# Altium schematic sheet USB_UART.SchDoc
size A4; DocumentNumber: 29; SheetNumber: 29; SheetTotal: 30
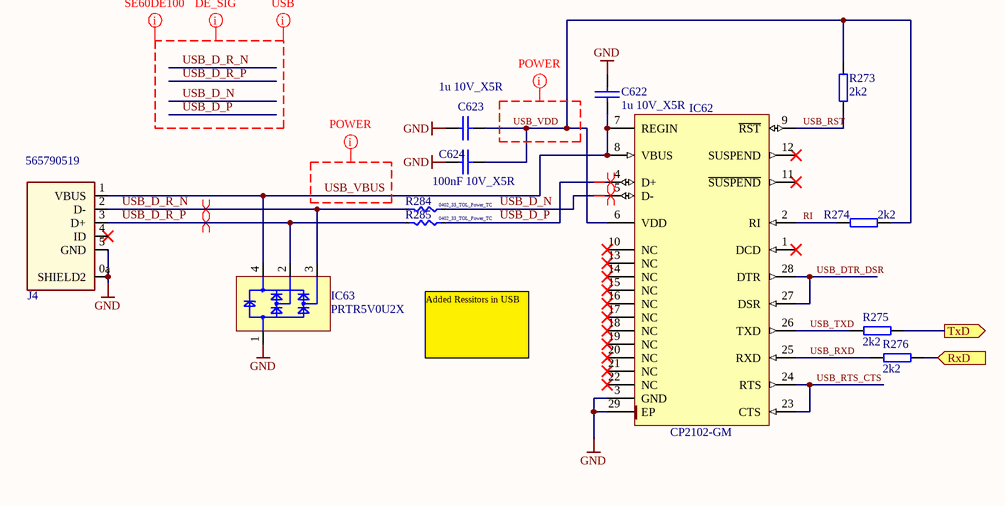
[diagram p0: USB_UART.SchDoc]

## Parts
C622  1u 10V_X5R  [0603C]
C623  1u 10V_X5R  [0603C]
C624  100nF 10V_X5R  [0402C]
IC62  CP2102-GM  [QFN50P500X500X100-29N-S335]
IC63  PRTR5V0U2X  [sot143b]
J4  565790519  [CON_USB_565790519]
R273  2k2  [0402R]
R274  2k2  [0402R]
R275  2k2  [0402R]
R276  2k2  [0402R]
R284  0402_33_TOL_Power_TC  [RESC1005X40N]
R285  0402_33_TOL_Power_TC  [RESC1005X40N]

## Ports
RxD (in), TxD (out)

## Nets
GND: C622.1 C623.1 C624.1 IC62.3(GND) IC62.29(EP) IC63.1 J4.0(SHIELD2) J4.0a(SHIELD2) J4.5(GND)
RI: IC62.2(RI) R274.1
RxD: R276.1 ; port RxD
TxD: R275.1 ; port TxD
USB_D_N: IC62.5(D-) R284.2(-)
USB_D_P: IC62.4(D+) R285.2(-)
USB_D_R_N: IC63.3 J4.2(D-) R284.1(+)
USB_D_R_P: IC63.2 J4.3(D+) R285.1(+)
USB_DTR_DSR: IC62.27(DSR) IC62.28(DTR)
USB_RST: IC62.9(~{RST}) R273.1
USB_RTS_CTS: IC62.23(CTS) IC62.24(RTS)
USB_RXD: IC62.25(RXD) R276.2
USB_TXD: IC62.26(TXD) R275.2
USB_VBUS: C622.2 IC62.7(REGIN) IC62.8(VBUS) IC63.4 J4.1(VBUS)
USB_VDD: C623.2 C624.2 IC62.6(VDD) R273.2 R274.2

Not connected (* = marked no-connect by the designer): IC62 1(DCD)* 10(NC)* 11(~{SUSPEND})* 12(SUSPEND)* 13(NC)* 14(NC)* 15(NC)* 16(NC)* 17(NC)* 18(NC)* 19(NC)* 20(NC)* 21(NC)* 22(NC)*; J4 4(ID)*

## Layout directives
differential pair: USB_D_N, USB_D_P, USB_D_R_N, USB_D_R_P
net class POWER: USB_VBUS, USB_VDD
net class SE60DE100: USB_D_N, USB_D_P, USB_D_R_N, USB_D_R_P
net class DE_SIG: USB_D_N, USB_D_P, USB_D_R_N, USB_D_R_P
net class USB: USB_D_N, USB_D_P, USB_D_R_N, USB_D_R_P

## Notes on the sheet
- Added Ressitors in USB

## Library data of the parts
C622 C623 = CAP_SMD_0603: Capacitor SMD; Supplier 1: Digi-Key; Supplier Part Number 1: 490-1524-2-ND
C624 = CAP_SMD_0402: Capacitor SMD; Supplier 1: Newark; Supplier Part Number 1: 14T3275
IC62 = CP2102-GM: Single-Chip USB to UART Bridge; Manufacturer: SILICON LABS; Table: Analog & Interface; Part Number: CP2102-GM; Component Kind: Standard; Component Type: Standard; Device: CP2102-GM; PackageDescription: QFN, 0.50mm Pitch, Square; 28 pin, 5.00mm L X 5.00mm W X 1.00mm H body (w/thermal tab 3.35 X 3.35mm),  IPC Medium Density; Part Description: Single-Chip USB to UART Bridge; Manufacturer Part Number: CP2102-GM; Pin Count: 29; Case: QFN28; Mounted: Yes; Socket: No; SMD: Yes; ComponentHeight: 1.0mm; Author: CERN DEM JLC; HelpURL: \\cern.ch\dfs\Applications\Altium\Datasheets\CP2102-GM.pdf; CreateDate: 3/3/2011; LatestRevisionDate: 3/3/2011
IC63 = D_TVS_PRTR5V0U2X: dual 5.5 ESD transient voltage suppressor
J4 = CON_USB_B_MINI_TH: USB mini B connector (Molex); Part Number: 10133; Device: USB_Mini_AB
R273-R276 = RES_0402: SMD Resistor; Supplier 1: Newark; Supplier Part Number 1: 59M6691
R284 R285 = SMT_0402: MiscInfo: Biggest Cern Footprint [max height]; Document Name: USB_UART.SchDoc; Part Number: SMT_0402; FootprintSizeX (mm): 1.8; FootprintSizeY (mm): 0.9; FootprintRectangleArea (mm): 1.62; Thickness (Max) (mm): 0.4; FootprintAlias: 0402